# EAGLE design NanoBud (EAGLE 9.1.1)
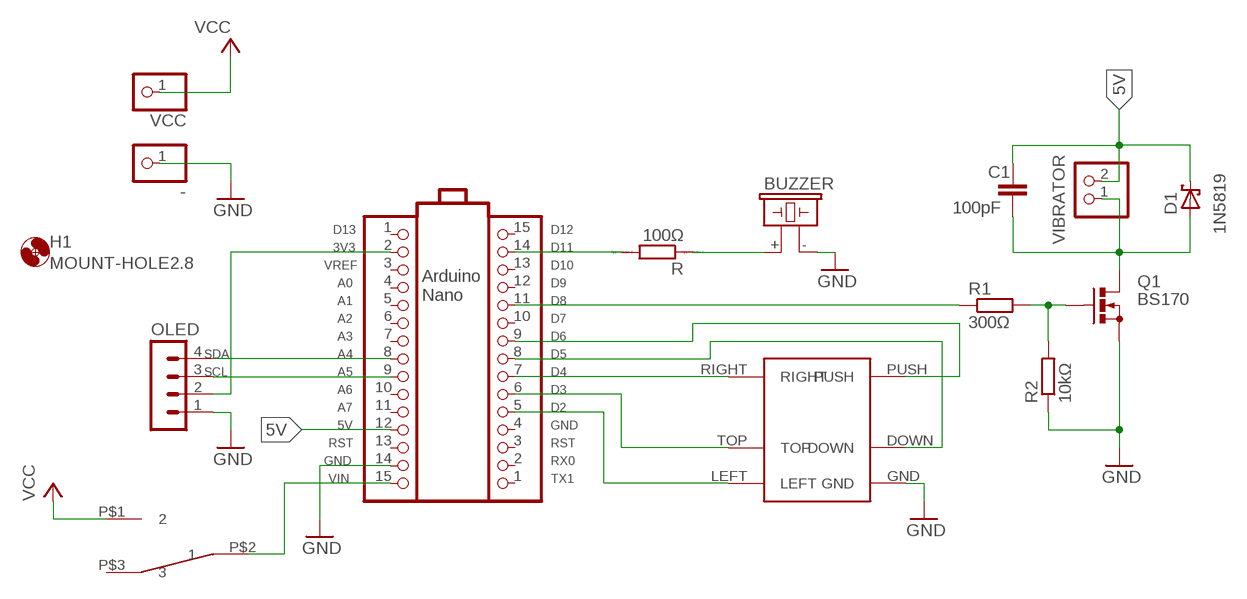
[diagram p0: schematic, sheet 1]

## Parts
-  PINHD-1X1  [1X01]
BUZZER  F/CM12P  [F/CM12P]
C1  100pF  C2.5/2  [C2.5-2]
D1  BAT49  [DO41-10]
H1  MOUNT-HOLE2.8  [2,8]
OLED  MA04-1  [MA04-1]
Q1  BS170  [SOT54E]
R  100Ω  R0204/7  [0204/7]
R1  300Ω  R-EU_0204/7  [0204/7]
R2  10kΩ  R-EU_0204/7  [0204/7]
SV1  PINHD-1X15  [1X15]
SV2  PINHD-1X15  [1X15]
U$1  SWITCHCHINOIS  [SWITCHCHINOIS]
U$2  MOMENTARYBUTTON  [MOMENTARYBUTTON]
VCC  PINHD-1X1  [1X01]
VIBRATOR  PINHD-1X2  [1X02]

## Nets
3V3: OLED.2 SV2.2
5V: C1.1 D1.C SV2.12 VIBRATOR.2
GND: -.1 BUZZER.- OLED.1 Q1.S R2.1 SV2.14 U$2.GND
N$1: SV1.5 U$2.LEFT
N$2: SV1.6 U$2.TOP
N$3: SV1.7 U$2.RIGHT
N$4: SV1.8 U$2.DOWN
N$5: SV1.9 U$2.PUSH
N$6: OLED.3 SV2.9
N$7: OLED.4 SV2.8
N$8: BUZZER.+ R.1
N$9: R.2 SV1.14
N$10: SV2.15 U$1.P$2
N$11: R1.1 SV1.11
N$12: Q1.G R1.2 R2.2
N$13: C1.2 D1.A Q1.D VIBRATOR.1
VCC: U$1.P$1 VCC.1
Unconnected: SV1.1 SV1.2 SV1.3 SV1.4 SV1.10 SV1.12 SV1.13 SV1.15 SV2.1 SV2.3 SV2.4 SV2.5 SV2.6 SV2.7 SV2.10 SV2.11 SV2.13 U$1.P$3

## Notes on the sheet
- D13 | D12 | 1N5819
- 3V3 | D11
- VREF | D10
- A0 | D9
- Arduino
  Nano
- A1 | D8
- A2 | D7
- A3 | D6
- SDA | A4 | D5
- SCL | A5 | D4
- A6 | D3
- A7 | D2
- 5V | GND
- RST | RST
- GND | RX0
- VIN | TX1

## Library data of the parts
- VCC = pinhead:PINHD-1X1: PIN HEADER
BUZZER = buzzer:F/CM12P: BUZZER Source: Buerklin; OC_FARNELL: unknown; OC_NEWARK: unknown
C1 = capacitor-wima:C: CAPACITOR naming: grid - package width
D1 = diode:BAT49: DIODE small signal diode
H1 = holes:MOUNT-HOLE: MOUNTING HOLE with drill center marker
OLED = con-lstb:MA04-1: PIN HEADER; OC_FARNELL: unknown; OC_NEWARK: unknown
Q1 = transistor-small-signal:BS170: N-CHANNEL MOS FET
R = eagle-ltspice:R: RESISTOR, European symbol; SPICEMODEL: NONE; SPICEPREFIX: R
R1 R2 = resistor:R-EU_: RESISTOR, European symbol
SV1 SV2 = pinhead:PINHD-1X15: PIN HEADER
U$1 = switchchinois:SWITCHCHINOIS
U$2 = momentarybutton:MOMENTARYBUTTON
VIBRATOR = pinhead:PINHD-1X2: PIN HEADER

## Board
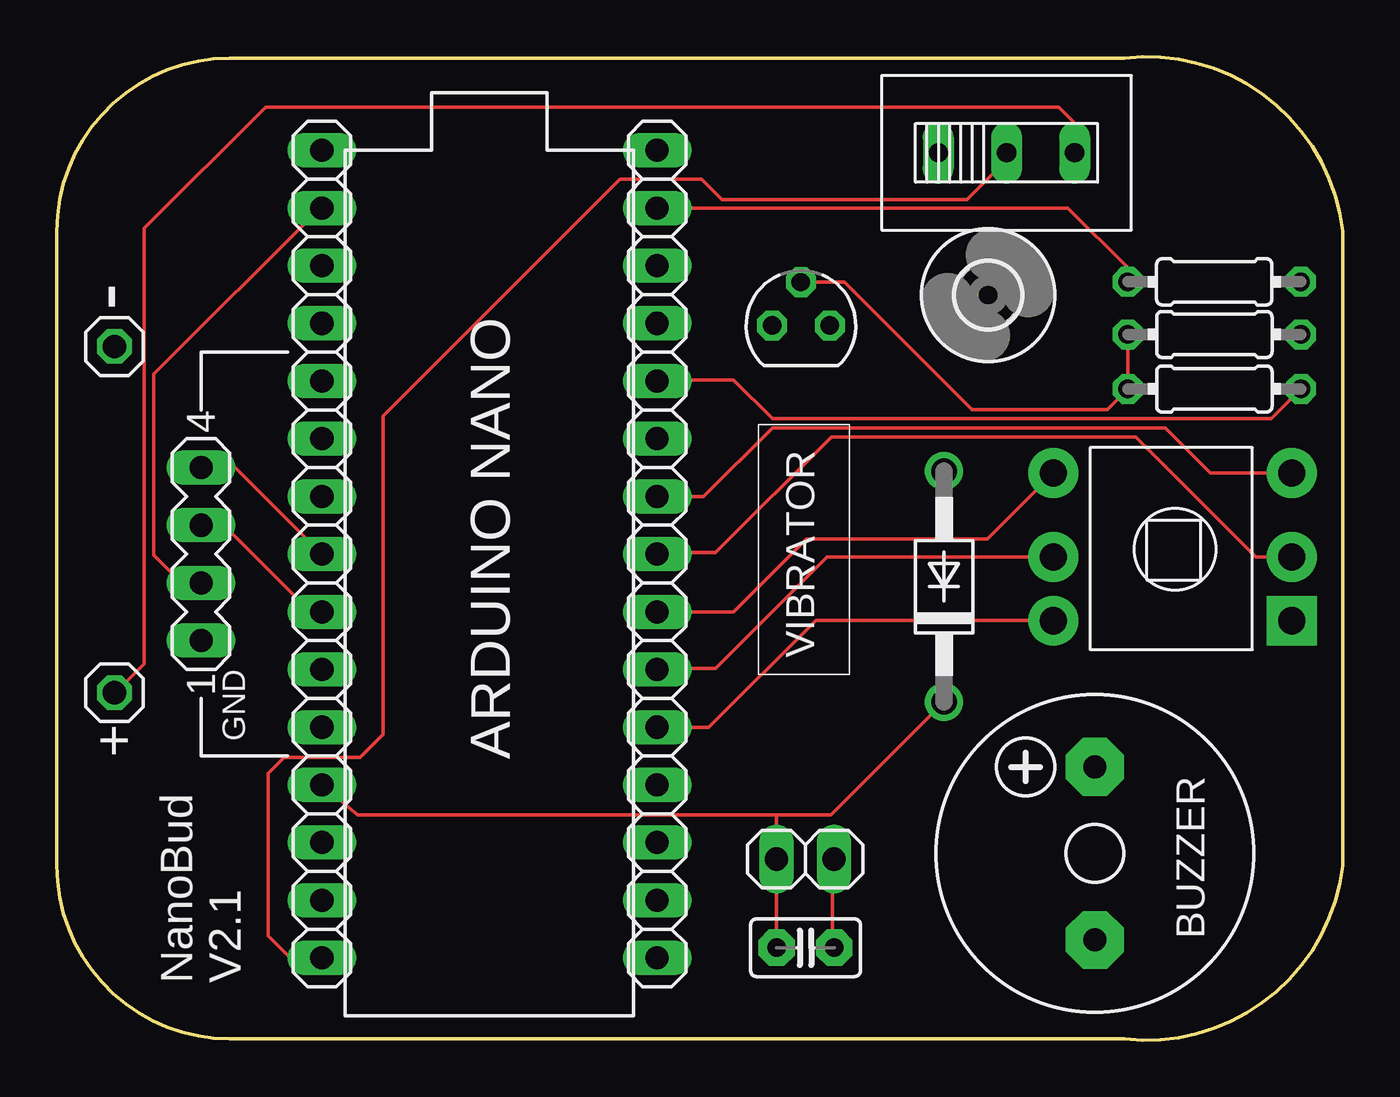
[diagram p1: board, top side]
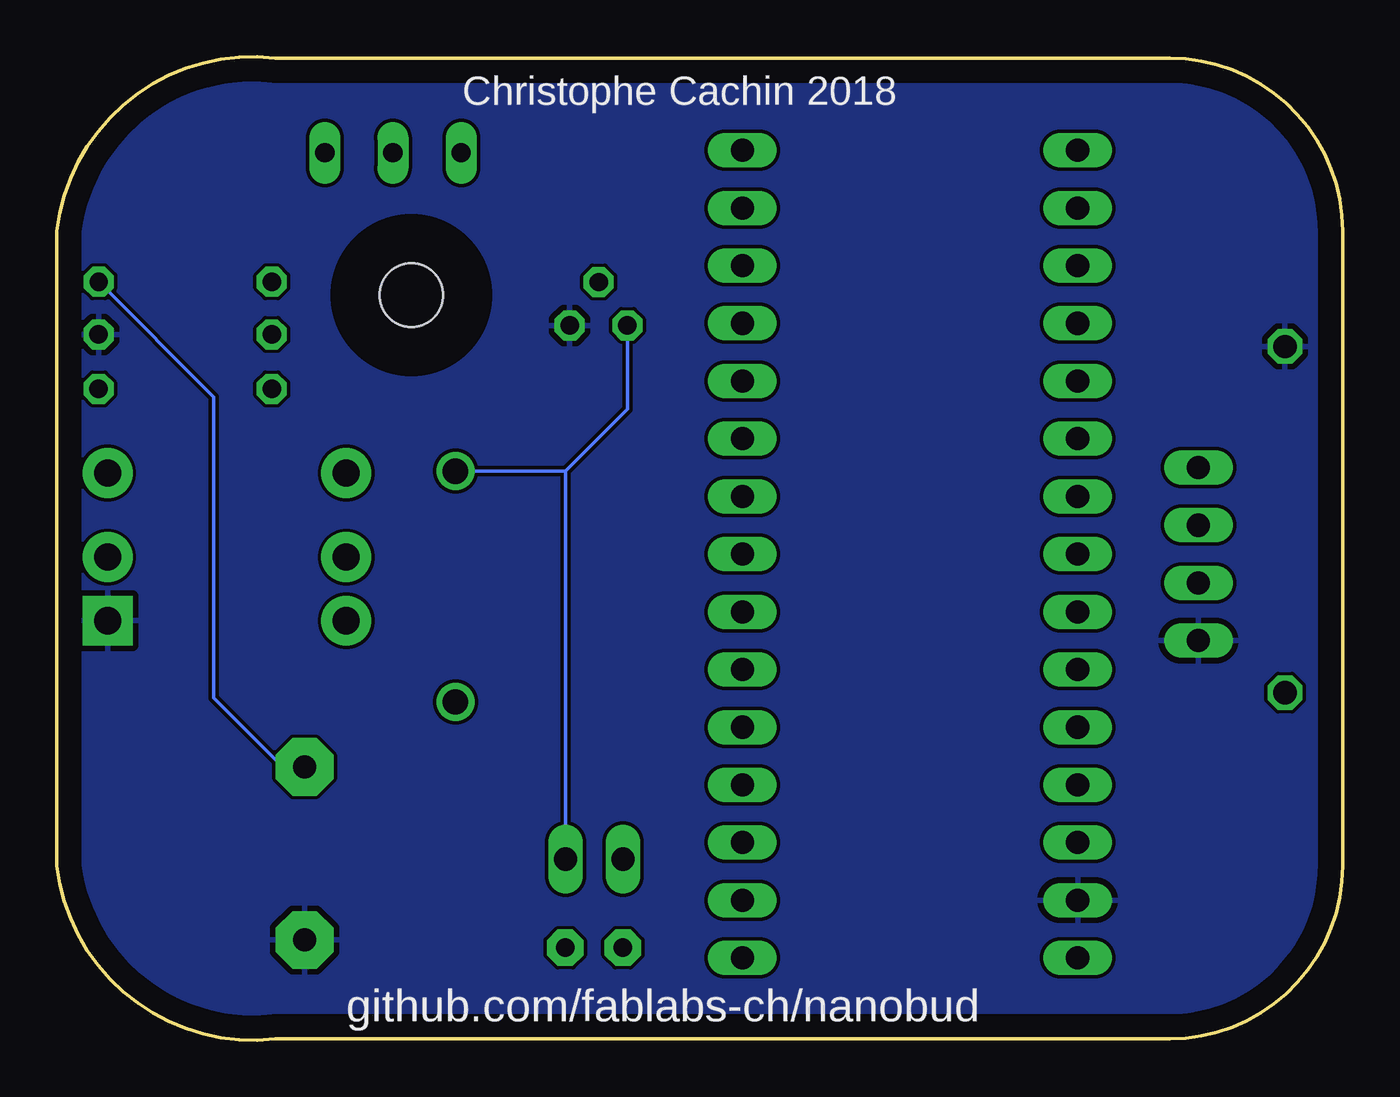
[diagram p2: board, bottom side, seen from below]

Size 56.61 x 43.29 mm. Coordinates in mm from the lower left corner, seen from the top.
Outline: 0,7.68 arc90 7.62,0.06 8.89,0.06 46.99,0.06 arc90 56.61,7.68 56.61,35.62 arc90 46.99,43.24 45.72,43.24 7.62,43.24 arc90 0,35.62 0,7.68
Copper layers (1*16): Top 0.035mm / dielectric 1.5mm / Bottom 0.035mm
Design rules "default": minimum track width 6mil, minimum drill 0.35mm, track to track 6mil, track to pad 6mil, pad to pad 6mil, via to via 6mil, smd to smd 6mil, copper to edge 40mil, drill to drill 6mil, minimum pad ring 10mil, minimum via ring 8mil, stop-mask expansion 4mil, vias tented up to drill 0mil, thermal gap 10mil

### Footprints (pad centres in the part's own frame; a part is rotated, then mirrored left to right if it is on the bottom)
1X01 = drill 1.016 octagon: 1 0,0
F/CM12P = drill 1.016 pad 2.54 octagon: + 3.81,0; - -3.81,0
C2.5-2 = drill 0.813 pad 1.6 octagon: 1 -1.27,0; 2 1.27,0
DO41-10 = drill 1.118: A 5.08,0; C -5.08,0
2,8 = hole 2.8: 0,0
MA04-1 = drill 1.016 long: 1 -3.81,0; 2 -1.27,0; 3 1.27,0; 4 3.81,0
SOT54E = drill 0.813 octagon: D -1.27,0; G 0,1.905; S 1.27,0
0204/7 = drill 0.813 octagon: 1 -3.81,0; 2 3.81,0
1X15 = drill 1.016 long: 1 -17.78,0; 2 -15.24,0; 3 -12.7,0; 4 -10.16,0; 5 -7.62,0; 6 -5.08,0; 7 -2.54,0; 8 0,0; 9 2.54,0; 10 5.08,0; 11 7.62,0; 12 10.16,0; 13 12.7,0; 14 15.24,0; 15 17.78,0
SWITCHCHINOIS = drill 0.85 long: P$1 -3,0; P$2 0,0; P$3 3,0
MOMENTARYBUTTON = drill 1.2 pad 2.184: DOWN -0.2,-5.2; LEFT -3,5.3; PUSH 3.5,-5.2; RIGHT 3.5,5.3; TOP -0.2,5.3 | drill 1.2 pad 2.184 square: GND -3,-5.2
1X02 = drill 1.016 long: 1 -1.27,0; 2 1.27,0

### Placement (x,y rotation side)
-  2.54,30.54 90 top
BUZZER  45.7,8.21 90 top
C1  32.96,4.07 0 top
D1  39.06,19.97 90 top
H1  41,32.8 0 top
OLED  6.35,21.4 90 top
Q1  32.76,31.47 0 top
R  50.95,33.38 180 top
R1  50.96,28.67 180 top
R2  50.96,31.07 180 top
SV1  26.43,21.4 90 top
SV2  11.67,21.4 270 top
U$1  41.81,39.07 180 top
U$2  49.17,21.47 90 top
VCC  2.54,15.3 90 top
VIBRATOR  32.95,7.97 180 top

### Tracks (layer width: path | path; a pad name or v marks a point on that pad's centre or on a via)
3V3
  Top 0.152: SV2.2 11.58,36.63 4.27,29.32 4.27,21.35 5.5,20.13 OLED.2
5V
  Top 0.152: C1.1 31.68,4.09 VIBRATOR.2 31.68,9.85 31.62,9.91 | 31.62,9.91 13.24,9.91 SV2.12 | D1.C 34.08,9.91 31.62,9.91
GND
  pour Bottom: 0,43.24 0,0.06 58.42,0.06 58.42,43.24
N$1
  Top 0.152: U$2.LEFT 33.41,18.47 28.7,13.76 26.45,13.76 SV1.5
N$2
  Top 0.152: U$2.TOP 33.91,21.27 29,16.36 26.47,16.36 SV1.6
N$3
  Top 0.152: U$2.RIGHT 40.96,22.06 33,22.06 29.8,18.86 SV1.7
N$4
  Top 0.152: U$2.DOWN 52.79,21.27 47.5,26.56 34.1,26.56 29,21.46 26.49,21.46 SV1.8
N$5
  Top 0.152: U$2.PUSH 50.79,24.97 48.8,26.96 31.5,26.96 28.48,23.94 SV1.9
N$6
  Top 0.152: SV2.9 11.58,18.95 11.06,18.95 7.35,22.67 OLED.3
N$7
  Top 0.152: SV2.8 7.86,25.21 OLED.4
N$8
  Bottom 0.152: R.1 49.7,28.32 49.7,15.06 46.67,12.02 BUZZER.+
N$9
  Top 0.152: SV1.14 26.52,36.63 44.52,36.63 47.14,34.01 R.2
N$10
  Top 0.152: SV2.15 10.28,3.62 9.31,4.59 9.31,11.74 10.02,12.45 13.34,12.45 14.36,13.47 14.36,27.46 24.8,37.9 28.38,37.9 29.29,36.99 40.07,36.99 41.81,38.74 U$1.P$2
N$11
  Top 0.152: R1.1 53.46,27.36 31.5,27.36 29.8,29.06 26.47,29.06 SV1.11
N$12
  Top 0.152: Q1.G 34.69,33.37 40.29,27.76 46.25,27.76 R1.2 R2.2
N$13
  Top 0.152: VIBRATOR.1 34.14,7.83 34.14,4.3 C1.2
  Bottom 0.152: 34.22,25.05 D1.A | VIBRATOR.1 34.22,25.05 | 34.22,25.05 31.49,27.78 Q1.D
VCC
  Top 0.152: VCC.1 2.59,15.3 3.86,16.56 3.86,35.74 9.19,41.07 44.11,41.07 44.81,40.37 U$1.P$1

### Text on the board
tPlace: - | GND | +
tNames: ARDUINO NANO | NanoBud / V2.1
bNames: Christophe Cachin 2018 | github.com/fablabs-ch/nanobud
tValues: Switch | BS170 | DISPLAY | Joystick | 1N5819